# EAGLE design ArduitsyR4 (EAGLE 8.0.0)
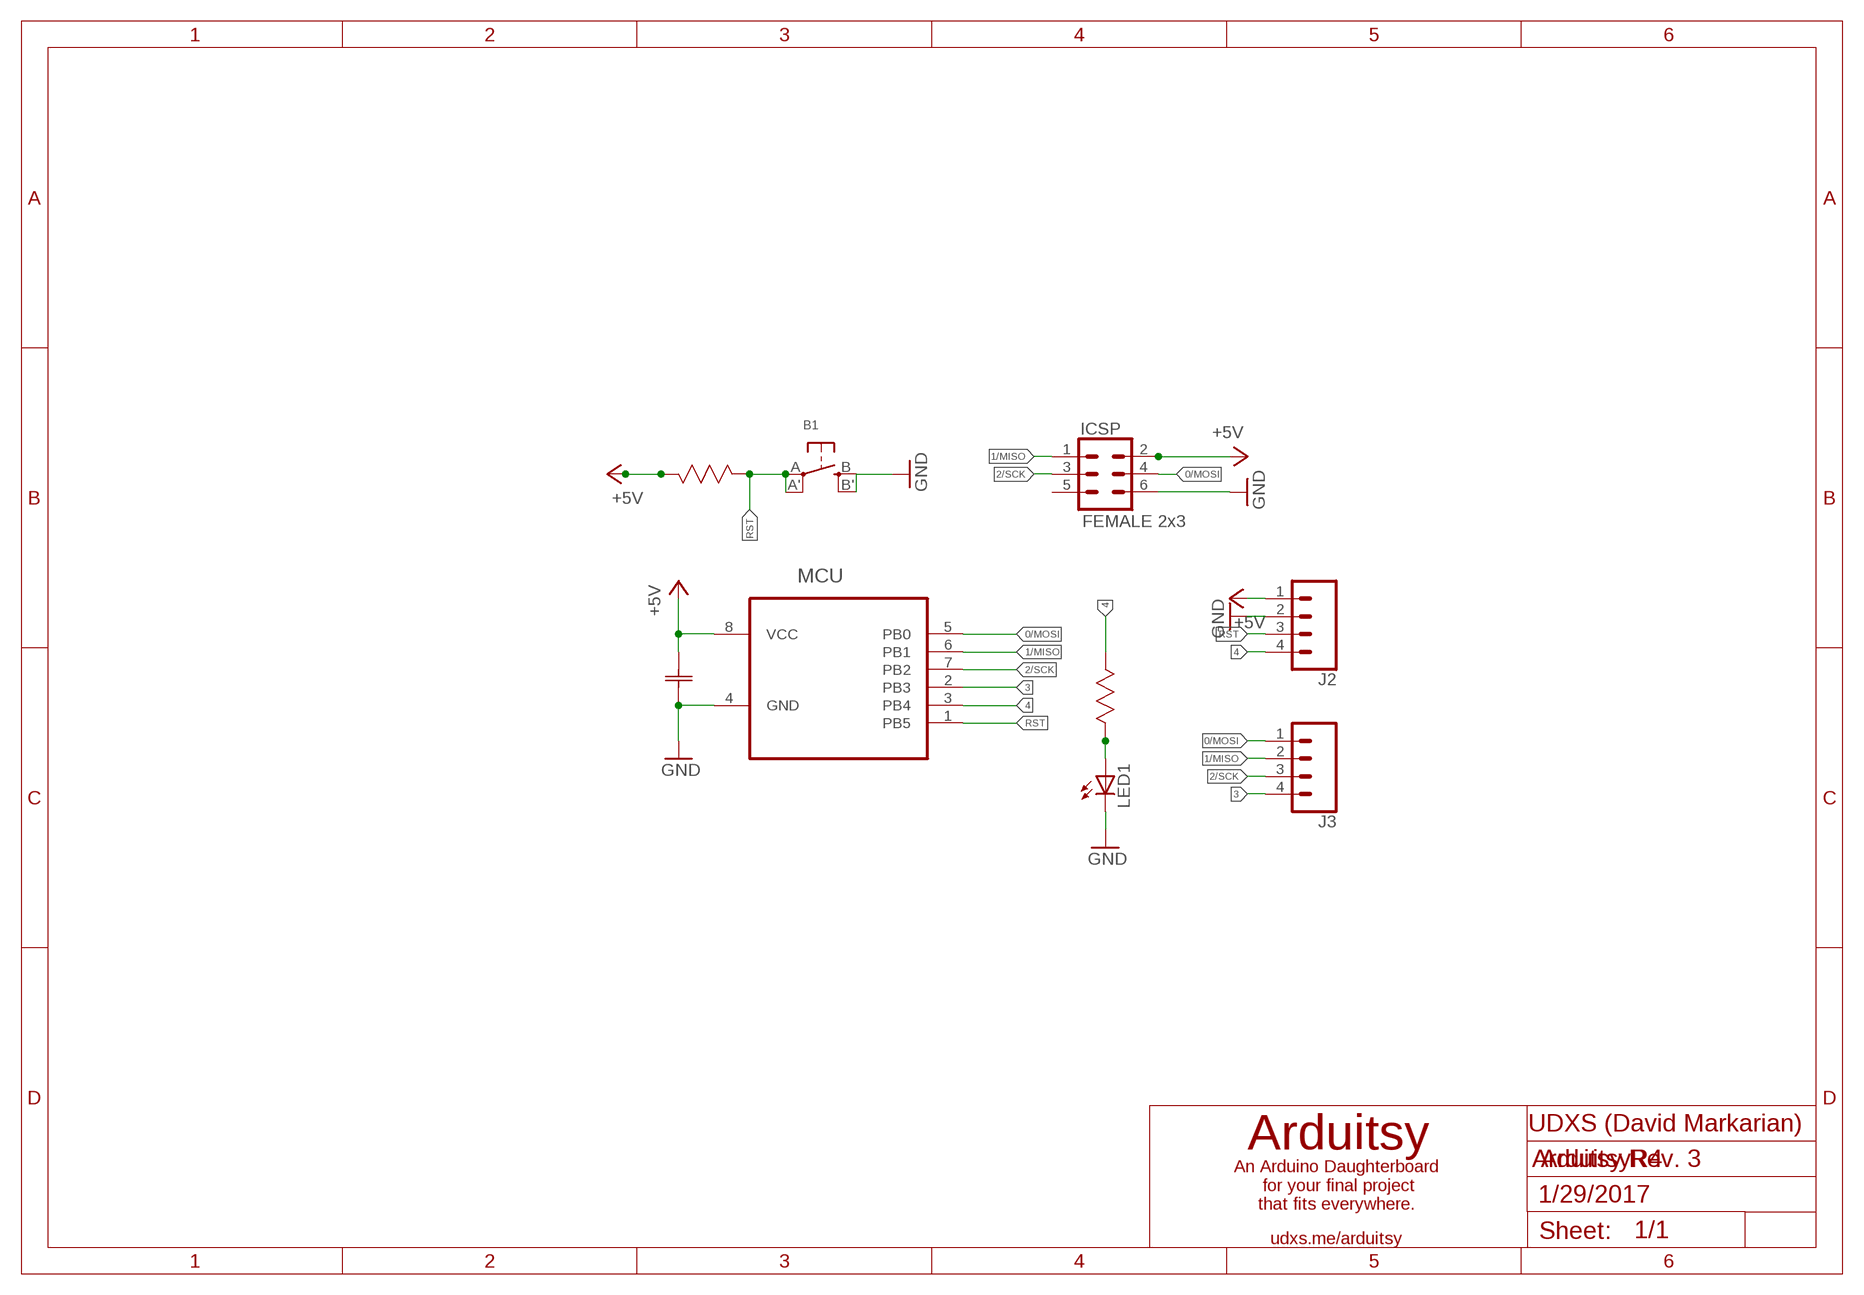
[diagram p0: schematic, sheet 1]

## Parts
B1  SWITCH_TACT_SMT  [EVQ-Q2]
C1  0.1µF  0805YC104KAT4A  [CAPC2012X94N]
ICSP  FEMALE 2x3  CONN_03X2FEMALE  [2X3]
J2  CONN_04  [1X04]
J3  CONN_04  [1X04]
LED1  LEDCHIPLED_0805  [CHIPLED_0805]
MCU  ATTINY85-20SU  [SOIC127P798X216-8N]
R1  10K Ohms  MC0.1W08051%10K  [RESC2013X65N]
R2  10K Ohms  MC0.1W08051%10K  [RESC2013X65N]

## Nets
0/MOSI: ICSP.4 J3.1 MCU.5(PB0)
1/MISO: ICSP.1 J3.2 MCU.6(PB1)
2/SCK: ICSP.3 J3.3 MCU.7(PB2)
3: J3.4 MCU.2(PB3)
4: J2.4 MCU.3(PB4) R2.1(R1)
+5V: C1.1(C1) ICSP.2 J2.1 MCU.8(VCC) R1.1(R1)
GND: B1.B'(S1) B1.B(S) C1.2(C2) ICSP.6 J2.2 LED1.C MCU.4(GND)
N$1: LED1.A R2.2(R2)
RST: B1.A'(P1) B1.A(P) J2.3 MCU.1(PB5) R1.2(R2)
Unconnected: ICSP.5

## Notes on the sheet
- UDXS (David Markarian)
- Arduitsy
- Arduitsy Rev. 3
- An Arduino Daughterboard
   for your final project
  that fits everywhere.
- 1/29/2017
- udxs.me/arduitsy

## Library data of the parts
B1 = microbuilder:SWITCH_TACT_SMT: SMT Tact Switches 6x6mm - Digikey: P12940SCT-ND KMR2 (4.6x2.8mm) - Digikey: 401-1426-1-ND EVQ-PQHB55 - Light Touch, 160GF (4.5x4.5mm) - Digikey: P8090SCT-ND
C1 = AVX_By_element14_Batch_1:0805YC104KAT4A: Capacitor 0805; MPN: 0805YC104KAT4A; OC_FARNELL: -; OC_NEWARK: 30H0642; SUPPLIER: AVX; TOLERANCE: ±10%; VOLTAGERATING: 16V
ICSP = SparkFun-Connectors:CONN_03X2: Multi connection point. Often used as Generic Header-pin footprint for 0.1 inch spaced/style header connections You can populate with any combo of single row headers, but if you'd like an exact match, check these: Header - 2x3 (Male, 0.1") <https://www.sparkfun.com/products/12807> (PRT-12807) Header - 2x3 (Female, 0.1") <https://www.sparkfun.com/products/13010> (PRT-13010) 2x3 Pin Shrouded Header <https://www.sparkfun.com/products/10877> (PRT-10877) On any of the 0.1 inch spaced packages, you can populate with these: Break Away Headers - Straight <https://www.sparkfun.com/products/116> (PRT-00116) Break Away Male Headers - Right Angle <https://www.sparkfun.com/products/553> (PRT-00553) Female Headers <https://www.sparkfun.com/products/115> (PRT-00115) Break Away Headers - Machine Pin <https://www.sparkfun.com/products/117> (PRT-00117) Break Away Female Headers - Swiss Machine Pin <https://www.sparkfun.com/products/743> (PRT-00743) Special note: the shrouded connector mates well with our 3x2 ribbon cables: Ribbon Crimp Connector - 6-pin (2x3, Female) <https://www.sparkfun.com/products/10651> (PRT-10651) Ribbon Cable - 6 wire (15ft) <https://www.sparkfun.com/products/10646> (PRT-10646); PROD_ID: CONN-11566
J2 J3 = SparkFun-Connectors:CONN_04: Multi connection point. Often used as Generic Header-pin footprint for 0.1 inch spaced/style header connections On any of the 0.1 inch spaced packages, you can populate with these: Break Away Headers - Straight <https://www.sparkfun.com/products/116> (PRT-00116) Break Away Male Headers - Right Angle <https://www.sparkfun.com/products/553> (PRT-00553) Female Headers <https://www.sparkfun.com/products/115> (PRT-00115) Break Away Headers - Machine Pin <https://www.sparkfun.com/products/117> (PRT-00117) Break Away Female Headers - Swiss Machine Pin <https://www.sparkfun.com/products/743> (PRT-00743) For SCREWTERMINALS and SPRING TERMINALS visit here: Screw Terimnals on SparkFun.com <https://www.sparkfun.com/search/results?term=Screw+Terminals> (5mm/3.5mm/2.54mm spacing) This device is also useful as a general connection point to wire up your design to another part of your project. Our various solder wires solder well into these plated through hole pads. Hook-Up Wire - Assortment (Stranded, 22 AWG) <https://www.sparkfun.com/products/11375> (PRT-11375) Hook-Up Wire - Assortment (Solid Core, 22 AWG) <https://www.sparkfun.com/products/11367> (PRT-11367) View the entire wire category on our website here <https://www.sparkfun.com/categories/141> Special notes: Molex polarized connector foot print use with SKU : PRT-08231 with associated crimp pins and housings. 1MM SMD Version SKU: PRT-10208; PROD_ID: CONN-09696
LED1 = adafruit:LED: LED OSRAM: - CHIPLED LG R971, LG N971, LY N971, LG Q971, LY Q971, LO R971, LY R971 LH N974, LH R974 LS Q976, LO Q976, LY Q976 LO Q996 - Hyper CHIPLED LW Q18S LB Q993, LB Q99A, LB R99A - SideLED LS A670, LO A670, LY A670, LG A670, LP A670 LB A673, LV A673, LT A673, LW A673 LH A674 LY A675 LS A676, LA A676, LO A676, LY A676, LW A676 LS A679, LY A679, LG A679 - Hyper Micro SIDELED® LS Y876, LA Y876, LO Y876, LY Y876 LT Y87S - SmartLED LW L88C, LW L88S LB L89C, LB L89S, LG L890 LS L89K, LO L89K, LY L89K LS L896, LA L896, LO L896, LY L896 - TOPLED LS T670, LO T670, LY T670, LG T670, LP T670 LSG T670, LSP T670, LSY T670, LOP T670, LYG T670 LG T671, LOG T671, LSG T671 LB T673, LV T673, LT T673, LW T673 LH T674 LS T676, LA T676, LO T676, LY T676, LB T676, LH T676, LSB T676, LW T676 LB T67C, LV T67C, LT T67C, LS T67K, LO T67K, LY T67K, LW E67C LS E67B, LA E67B, LO E67B, LY E67B, LB E67C, LV E67C, LT E67C LW T67C LS T679, LY T679, LG T679 LS T770, LO T770, LY T770, LG T770, LP T770 LB T773, LV T773, LT T773, LW T773 LH T774 LS E675, LA E675, LY E675, LS T675 LS T776, LA T776, LO T776, LY T776, LB T776 LHGB T686 LT T68C, LB T68C - Hyper Mini TOPLED® LB M676 - Mini TOPLED Santana® LG M470 LS M47K, LO M47K, LY M47K Source: http://www.osram.convergy.de/
MCU = Atmel_By_element14_Batch_1-00:ATTINY85-20SU: 8-bit Microcontroller with In-System Programmable Flash; MPN: ATTINY85-20SU; OC_FARNELL: 1455164; OC_NEWARK: 58M3797; PACKAGE: SOIC-8; SUPPLIER: Atmel
R1 R2 = Multicomp_By_element14_Batch_1:MC0.1W08051%10K: RESISTOR, 0805; MPN: MC0.1W08051%10K; OC_FARNELL: 9332391; OC_NEWARK: -; SUPPLIER: Multicomp; TOLERANCE: ±1%; WATTAGE: 1/10 W

## Board
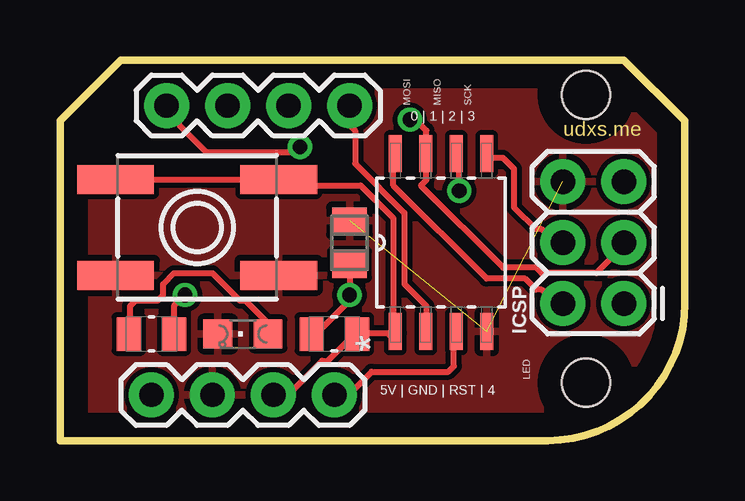
[diagram p1: board, top side]
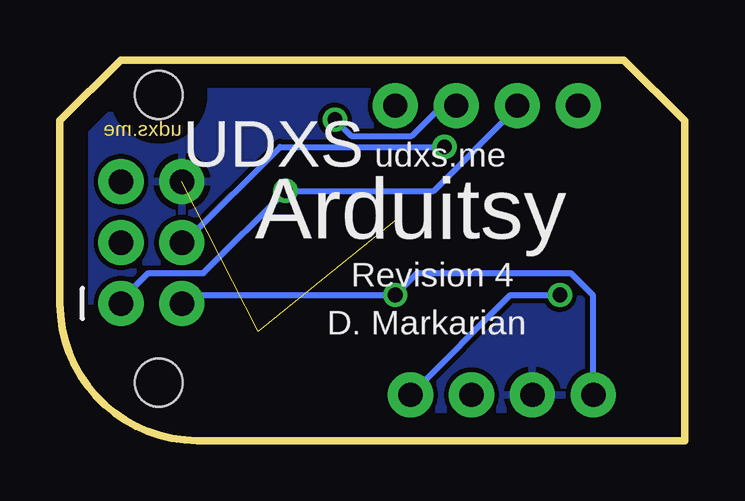
[diagram p2: board, bottom side, seen from below]

Size 26.03 x 15.88 mm. Coordinates in mm from the lower left corner, seen from the top.
Outline: 0,13.33 2.54,15.88 23.49,15.88 26.03,13.33 26.03,5.71 arc-90 20.32,0 0,0 0,13.33
Copper layers (1*16): Top 0.035mm / dielectric 1.5mm / Bottom 0.035mm
Design rules "default": minimum track width 10mil, minimum drill 24mil, track to track 8mil, track to pad 8mil, pad to pad 8mil, via to via 8mil, smd to smd 8mil, copper to edge 40mil, drill to drill 8mil, minimum pad ring 10mil, minimum via ring 8mil, stop-mask expansion 4mil, vias tented up to drill 0mil, thermal gap 10mil
Holes 2 mm at 21.92,14.41 21.92,2.41

### Footprints (pad centres in the part's own frame; a part is rotated, then mirrored left to right if it is on the bottom)
EVQ-Q2 = smd 3.2 x 1.2: A -3.4,-2; A' 3.4,-2; B -3.4,2; B' 3.4,2
CAPC2012X94N = smd 1.118 x 1.448: 1 -0.914,0; 2 0.914,0
2X3 = drill 1.016 pad 1.88: 1 0,0; 2 0,2.54; 3 2.54,0; 4 2.54,2.54; 5 5.08,0; 6 5.08,2.54
1X04 = drill 1.016 pad 1.88: 1 0,0; 2 2.54,0; 3 5.08,0; 4 7.62,0
CHIPLED_0805 = smd 1.2 x 1.2: A 0,-1.05; C 0,1.05
SOIC127P798X216-8N = smd 1.549 x 0.533: 1 -3.708,1.905; 2 -3.708,0.635; 3 -3.708,-0.635; 4 -3.708,-1.905; 5 3.708,-1.905; 6 3.708,-0.635; 7 3.708,0.635; 8 3.708,1.905
RESC2013X65N = smd 1.016 x 1.397: 1 -0.94,0; 2 0.94,0

### Placement (x,y rotation side)
B1  5.71,8.89 180 top
C1  12.06,8.25 90 top
ICSP  23.49,5.71 90 top
J2  3.81,1.91 0 top
J3  4.45,13.97 0 top
LED1  7.62,4.45 90 top
MCU  15.87,8.25 90 top
R1  11.43,4.45 0 top
R2  3.81,4.45 180 top

### Tracks (layer width: path | path; a pad name or v marks a point on that pad's centre or on a via)
0/MOSI  (via drill 0.61)
  Top 0.254: MCU.5 17.78,11.79 18.47,11.79 18.92,11.33 18.92,9.73 19.84,8.81 20.07,8.81 20.75,8.13 ICSP.4 | v10.01,12.24 9.78,12.01 6.12,12.01 4.98,13.16 4.98,13.39 4.52,13.84 J3.1
  Bottom 0.254: v10.01,12.24 16.87,12.24 20.75,8.36 ICSP.4
1/MISO  (via drill 0.61)
  Top 0.254: v16.64,10.41 16.64,11.79 MCU.6
  Bottom 0.254: ICSP.1 23.49,5.84 22.35,6.98 20.07,6.98 v16.64,10.41 10.46,10.41 7.04,13.84 J3.2
2/SCK  (via drill 0.61)
  Top 0.254: ICSP.3 23.49,8.13 22.35,6.98 20.07,6.98 19.84,7.21 18.47,7.21 15.04,10.64 15.26,10.87 15.26,11.79 MCU.7 15.26,12.01 15.26,12.93 14.81,13.39 v14.58,13.39
  Bottom 0.254: v14.58,13.39 13.89,12.7 11.38,12.7 10.24,13.84 9.55,13.84 J3.3
3
  Top 0.254: J3.4 12.06,13.16 12.29,12.93 12.29,11.56 14.35,9.5 14.35,6.53 15.26,5.61 15.26,4.7 MCU.2
4  (via drill 0.61)
  Top 0.254: R2.1 4.75,5.61 v5.21,6.07 | MCU.3 16.41,4.47 16.41,3.1 16.18,2.87 12.98,2.87 12.06,1.96 11.61,1.96 J2.4
  Bottom 0.254: v5.21,6.07 7.26,6.07 J2.4
+5V  (via drill 0.61)
  Top 0.254: C1.1 v12.06,6.07 12.06,5.84 10.69,4.47 R1.1 | MCU.8 13.89,11.79 13.89,10.64 17.78,6.76 19.38,6.76 19.84,6.3 20.07,6.3 20.75,5.61 ICSP.2
  Bottom 0.254: ICSP.2 20.75,5.84 20.52,6.07 v12.06,6.07 11.15,6.98 4.75,6.98 3.83,6.07 3.83,1.96 J2.1
GND  (2 unrouted)
  pour Top: -5.08,8.41 -5.08,18.41 3.92,18.41 34.92,18.41 34.92,-3.59 27.92,-3.59 -4.08,-3.59 -4.08,8.41
  pour Bottom: -3.08,18.41 29.92,18.41 29.92,-4.59 21.92,-4.59 -5.08,-4.59 -5.08,18.41
N$1
  Top 0.254: LED1.A 8.64,4.47 8.64,4.93 7.72,5.84 7.49,5.84 6.35,6.98 4.75,6.98 4.29,6.53 4.29,6.07 4.06,5.84 3.15,5.84 2.92,5.61 2.92,4.47 R2.2
RST
  Top 0.254: J2.3 9.09,1.96 9.55,1.96 10.92,3.33 11.15,3.33 12.06,4.24 12.29,4.24 R1.2 12.52,4.47 13.67,4.47 13.89,4.24 14.12,4.47 MCU.1 13.89,4.7 13.89,9.27 12.52,10.64 9.55,10.64 9.32,10.87 B1.A 9.09,10.87 2.46,10.87 B1.A'

### Text on the board
Dimension: udxs.me
tPlace: MOSI | MISO | SCK | 0 | 1 | 2 | 3 | LED | 5V | GND | RST | 4
bPlace: udxs.me | UDXS | Arduitsy | Revision 4 | D. Markarian